# Altium schematic sheet AD7124四线制方案.SchDoc
size A4
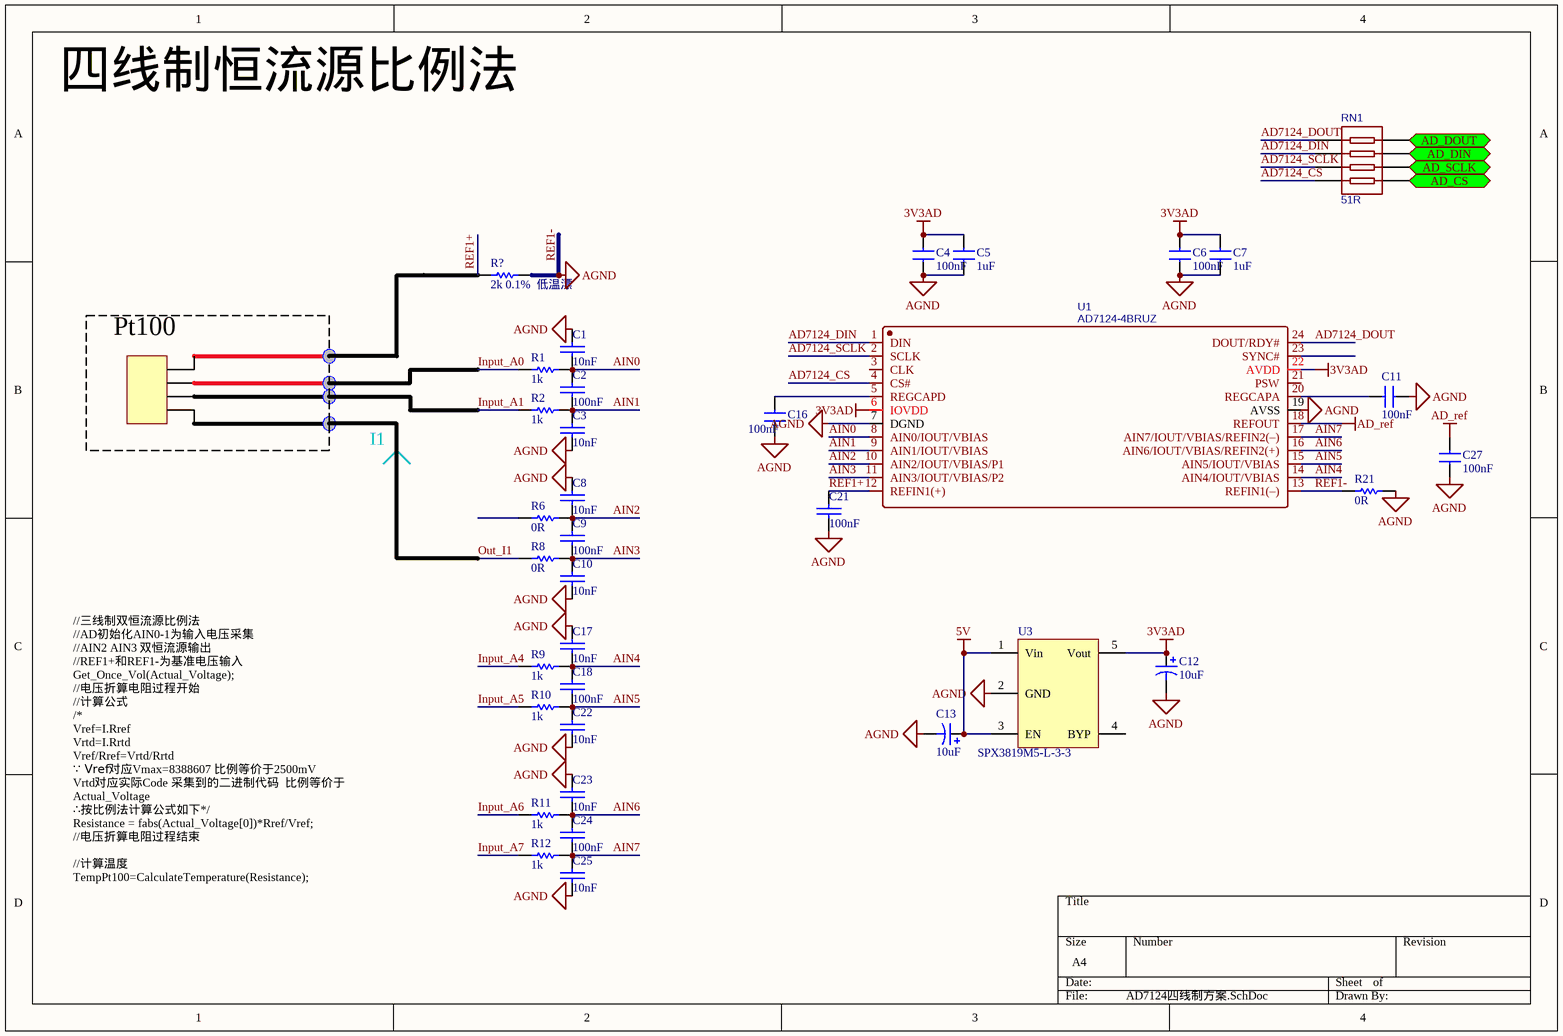
[diagram p0: AD7124四线制方案.SchDoc]

## Parts
C1  10nF  [C0603]
C2  100nF  [C0603]
C3  10nF  [C0603]
C4  100nF  [C0603]
C5  1uF  [C0603]
C6  100nF  [C0603]
C7  1uF  [C0603]
C8  10nF  [C0603]
C9  100nF  [C0603]
C10  10nF  [C0603]
C11  100nF  [C0603]
C12  10uF  [C0603]
C13  10uF  [C0603]
C16  100nF  [C0603]
C17  10nF  [C0603]
C18  100nF  [C0603]
C21  100nF  [C0603]
C22  10nF  [C0603]
C23  10nF  [C0603]
C24  100nF  [C0603]
C25  10nF  [C0603]
C27  100nF  [C0603]
R1  1k  [0603-1]
R2  1k  [0603-1]
R6  0R  [0603-1]
R8  0R  [0603-1]
R9  1k  [0603-1]
R10  1k  [0603-1]
R11  1k  [0603-1]
R12  1k  [0603-1]
R21  0R  [0603-1]
R?  2k 0.1%  低温漂  [0603-1]
RN1  51R  [0603_X4]
U1  AD7124-4BRUZ  [TSSOP24_44MM_065P]
U3  SPX3819M5-L-3-3  [SOT-23-5]

## Ports
AD_CS (bidir), AD_DIN (bidir), AD_DOUT (bidir), AD_SCLK (bidir)

## Nets
3V3AD: C4.2 C5.2 C6.2 C7.2 C12.1 U1.6(IOVDD) U1.22(AVDD) U3.5(Vout)
5V: C13.1 U3.1(Vin) U3.3(EN)
AD_ref: C27.2 U1.18(REFOUT)
REF1-: C1.1 C3.2 C4.1 C5.1 C6.1 C7.1 C8.1 C10.2 C11.2 C12.2 C13.2 C16.1 C17.1 C21.2 C22.2 C23.1 C25.2 C27.1 R21.1 R21.2 R?.2 U1.7(DGND) U1.13(REFIN1(–)) U1.19(AVSS) U3.2(GND)  [also labelled AGND]
AD7124_CS: RN1.1 U1.4(CS#)
AD7124_DIN: RN1.3 U1.1(DIN)
AD7124_DOUT: RN1.4 U1.24(DOUT/RDY#)
AD7124_SCLK: RN1.2 U1.2(SCLK)
AD_CS: RN1.8 ; port AD_CS
AD_DIN: RN1.6 ; port AD_DIN
AD_DOUT: RN1.5 ; port AD_DOUT
AD_SCLK: RN1.7 ; port AD_SCLK
AIN0: C1.2 C2.1 R1.1 U1.8(AIN0/IOUT/VBIAS)
AIN1: C2.2 C3.1 R2.1 U1.9(AIN1/IOUT/VBIAS)
AIN2: C8.2 C9.1 R6.1 U1.10(AIN2/IOUT/VBIAS/P1)
AIN3: C9.2 C10.1 R8.1 U1.11(AIN3/IOUT/VBIAS/P2)
AIN4: C17.2 C18.1 R9.1 U1.14(AIN4/IOUT/VBIAS)
AIN5: C18.2 C22.1 R10.1 U1.15(AIN5/IOUT/VBIAS)
AIN6: C23.2 C24.1 R11.1 U1.16(AIN6/IOUT/VBIAS/REFIN2(+))
AIN7: C24.2 C25.1 R12.1 U1.17(AIN7/IOUT/VBIAS/REFIN2(–))
Input_A0: R1.2
Input_A1: R2.2
Input_A4: R9.2
Input_A5: R10.2
Input_A6: R11.2
Input_A7: R12.2
Out_I1: R8.2
REF1+: C21.1 R?.1 U1.12(REFIN1(+))
NetC11_1: C11.1 U1.20(REGCAPA)
NetC16_2: C16.2 U1.5(REGCAPD)

Not connected (* = marked no-connect by the designer): R6 2; U1 3(CLK) 21(PSW) 23(SYNC#); U3 4(BYP)

## Notes on the sheet
- 四线制恒流源比例法
- Pt100
- //三线制双恒流源比例法
  //AD初始化AIN0-1为输入电压采集
  //AIN2 AIN3 双恒流源输出
  //REF1+和REF1-为基准电压输入
  Get_Once_Vol(Actual_Voltage);
  //电压折算电阻过程开始
  //计算公式
  /*
  Vref=I.Rref
  Vrtd=I.Rrtd
  Vref/Rref=Vrtd/Rrtd
  ∵ Vref对应Vmax=8388607 比例等价于2500mV
  Vrtd对应实际Code 采集到的二进制代码  比例等价于Actual_Voltage
  ∴按比例法计算公式如下*/
  Resistance = fabs(Actual_Voltage[0])*Rref/Vref;
  //电压折算电阻过程结束
  //计算温度
  TempPt100=CalculateTemperature(Resistance);
- Labels drawn without touching a wire or pin: I1

## Library data of the parts
C1-C3 C8-C10 C17 C18 C21-C25 = CAP: 电容
C4-C7 C11 C16 C27 = C: 电容
C12 C13 = CAP2: 电解电容
R1 R2 R6 R8-R12 R21 = RES: 电阻
R? = Res Semi: 电阻; Value: 1K; Published: 8-Jun-2000; LatestRevisionDate: 17-Jul-2002; LatestRevisionNote: Re-released for DXP Platform.; PackageReference: AXIAL-0.5; Publisher: Altium Limited
RN1 = 51: BOM_Manufacturer: UniOhm; BOM_Manufacturer Part: 4D03WGJ0510T5E; nameAlias: Resistance (Ohms); SMT Type: Extend; BOM_Supplier: LCSC; BOM_Supplier Part: C12031; BOM_LCSC Assembly: Yes; spicePre: R; spiceSymbolName: 4D03WGJ0510T5E
U1 = AD7124-4BRUZ: BOM_Manufacturer: ADI; spicePre: X; BOM_Manufacturer Part: AD7124-4BRUZ; BOM_Supplier: LCSC; BOM_Supplier Part: C67717; spiceSymbolName: AD7124-4BRUZ
U3 = SPX3819: LDO芯片